# EAGLE design Inverter V3 (EAGLE 9.6.2)
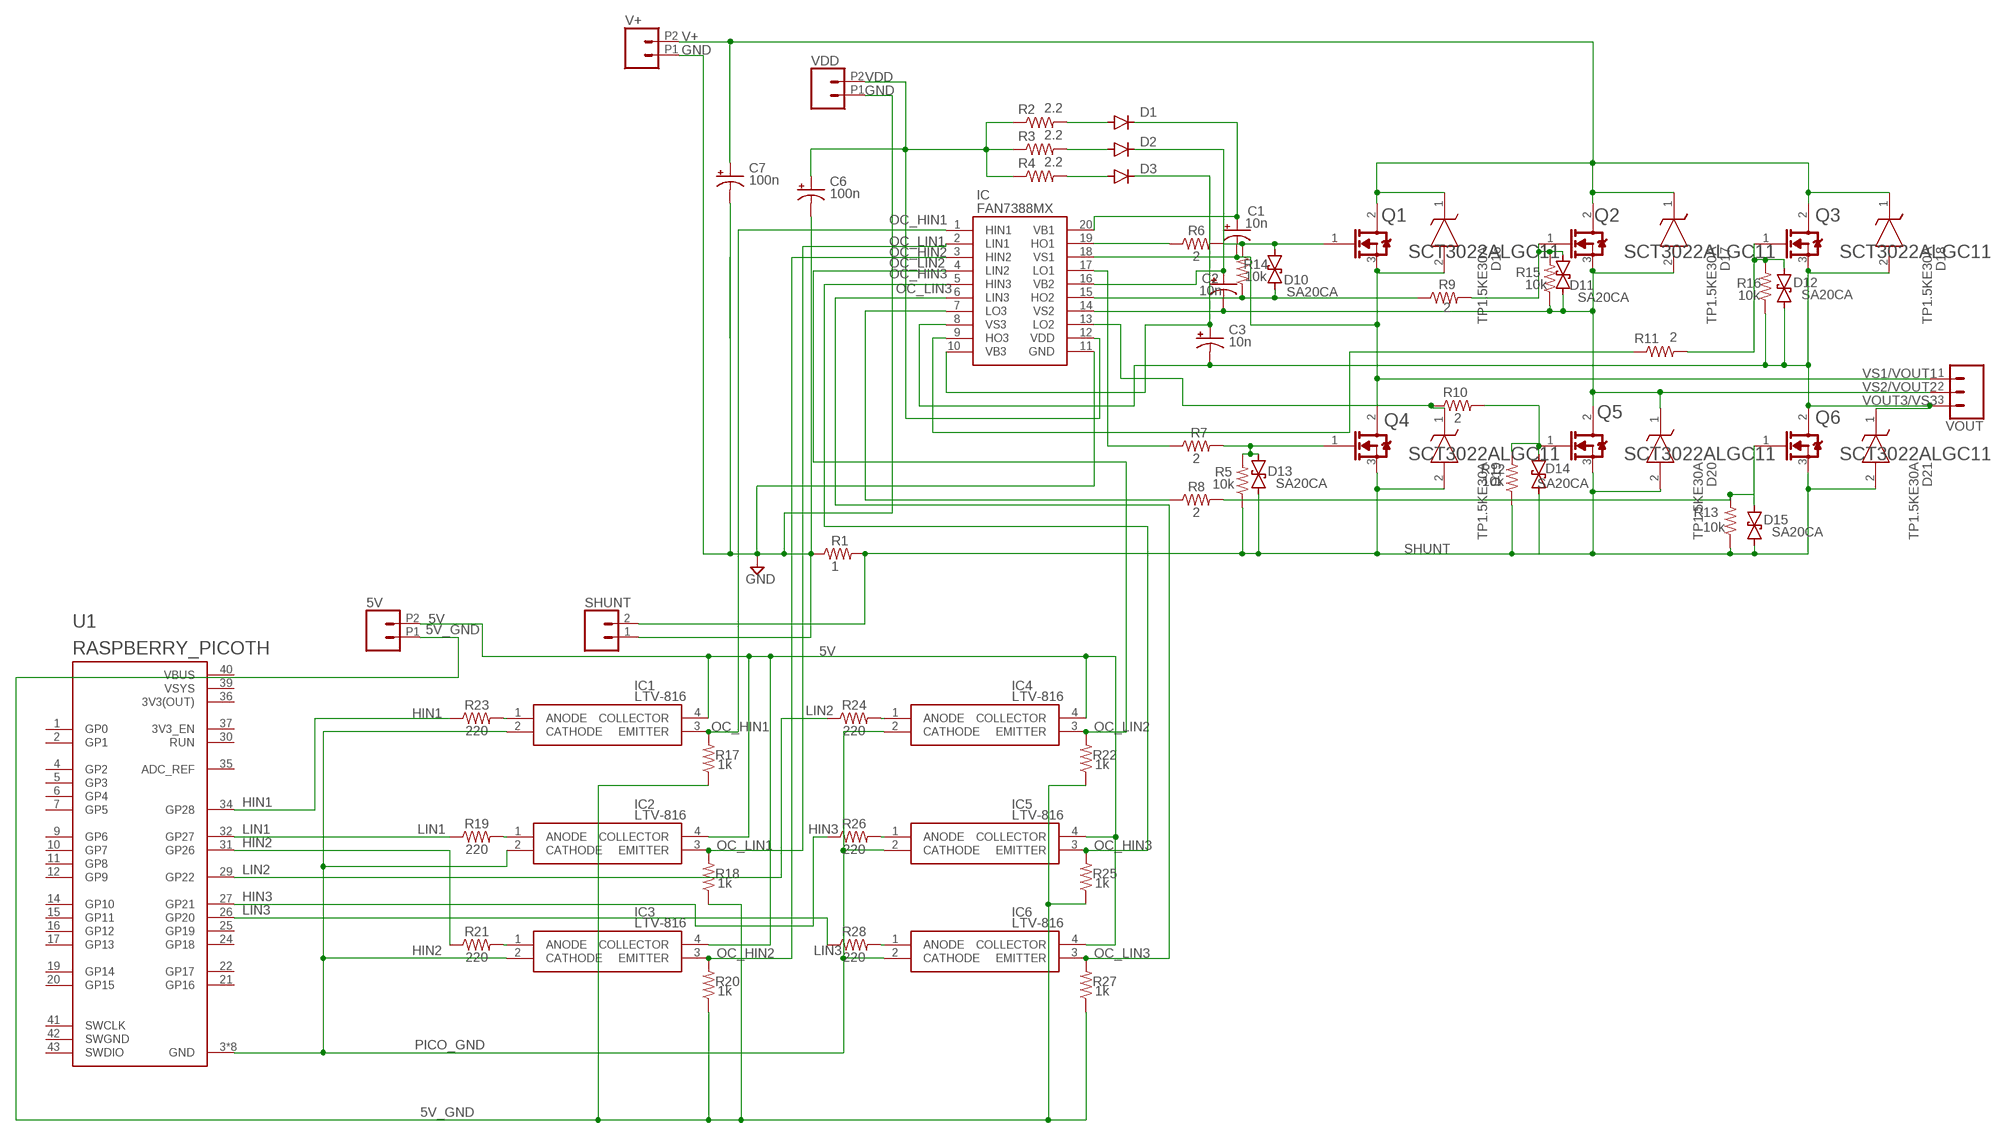
[diagram p0: schematic, sheet 1]

## Parts
5V  CONN_022.54MM_SCREWTERM  [1X02_2.54_SCREWTERM]
C1  10n  CPOL-USSMCZ  [SMC_Z]
C2  10n  CPOL-USSMCZ  [SMC_Z]
C3  10n  CPOL-USSMCZ  [SMC_Z]
C6  100n  CPOL-USSMCZ  [SMC_Z]
C7  100n  CPOL-USE5-5  [E5-5]
D1  DIODE-GF1  [GF1]
D2  DIODE-GF1  [GF1]
D3  DIODE-GF1  [GF1]
D10  SA20CA  P6KEXXC  [CB417-15]
D11  SA20CA  P6KEXXC  [CB417-15]
D12  SA20CA  P6KEXXC  [CB417-15]
D13  SA20CA  P6KEXXC  [CB417-15]
D14  SA20CA  P6KEXXC  [CB417-15]
D15  SA20CA  P6KEXXC  [CB417-15]
D16  TP1.5KE30A  [DIOAD2855W107L835D505]
D17  TP1.5KE30A  [DIOAD2855W107L835D505]
D18  TP1.5KE30A  [DIOAD2855W107L835D505]
D19  TP1.5KE30A  [DIOAD2855W107L835D505]
D20  TP1.5KE30A  [DIOAD2855W107L835D505]
D21  TP1.5KE30A  [DIOAD2855W107L835D505]
IC  FAN7388MX  [SOIC127P1032X265-20N]
IC1  LTV-816  [DIP762W60P254L460H450Q4N]
IC2  LTV-816  [DIP762W60P254L460H450Q4N]
IC3  LTV-816  [DIP762W60P254L460H450Q4N]
IC4  LTV-816  [DIP762W60P254L460H450Q4N]
IC5  LTV-816  [DIP762W60P254L460H450Q4N]
IC6  LTV-816  [DIP762W60P254L460H450Q4N]
Q1  ROHM_SCT3022ALGC11ROHM_SCT3022ALGC11_0_0  [ROHM_SCT3022ALGC11_0]
Q2  ROHM_SCT3022ALGC11ROHM_SCT3022ALGC11_0_0  [ROHM_SCT3022ALGC11_0]
Q3  ROHM_SCT3022ALGC11ROHM_SCT3022ALGC11_0_0  [ROHM_SCT3022ALGC11_0]
Q4  ROHM_SCT3022ALGC11ROHM_SCT3022ALGC11_0_0  [ROHM_SCT3022ALGC11_0]
Q5  ROHM_SCT3022ALGC11ROHM_SCT3022ALGC11_0_0  [ROHM_SCT3022ALGC11_0]
Q6  ROHM_SCT3022ALGC11ROHM_SCT3022ALGC11_0_0  [ROHM_SCT3022ALGC11_0]
R1  1  R-US_0207/10  [0207/10]
R2  2.2  RESISTOR0603  [0603]
R3  2.2  RESISTOR0603  [0603]
R4  2.2  RESISTOR0603  [0603]
R5  10k  RESISTOR0603  [0603]
R6  2  RESISTOR0603  [0603]
R7  2  RESISTOR0603  [0603]
R8  2  RESISTOR0603  [0603]
R9  2  RESISTOR0603  [0603]
R10  2  RESISTOR0603  [0603]
R11  2  RESISTOR0603  [0603]
R12  10k  RESISTOR0603  [0603]
R13  10k  RESISTOR0603  [0603]
R14  10k  RESISTOR0603  [0603]
R15  10k  RESISTOR0603  [0603]
R16  10k  RESISTOR0603  [0603]
R17  1k  RESISTOR0603  [0603]
R18  1k  RESISTOR0603  [0603]
R19  220  RESISTOR0603  [0603]
R20  1k  RESISTOR0603  [0603]
R21  220  RESISTOR0603  [0603]
R22  1k  RESISTOR0603  [0603]
R23  220  RESISTOR0603  [0603]
R24  220  RESISTOR0603  [0603]
R25  1k  RESISTOR0603  [0603]
R26  220  RESISTOR0603  [0603]
R27  1k  RESISTOR0603  [0603]
R28  220  RESISTOR0603  [0603]
SHUNT  CONN_02PTH4  [1X02_XTRA_BIG]
U1  RASPBERRY_PICOTH  [PICO-PKG-TH]
V+  CONN_022.54MM_SCREWTERM  [1X02_2.54_SCREWTERM]
VDD  CONN_022.54MM_SCREWTERM  [1X02_2.54_SCREWTERM]
VOUT  CONN_03SCREW-NS  [SCREWTERMINAL-3.5MM-3-NS]

## Nets
5V: 5V.P2 IC1.4(COLLECTOR) IC2.4(COLLECTOR) IC3.4(COLLECTOR) IC4.4(COLLECTOR) IC5.4(COLLECTOR) IC6.4(COLLECTOR)
5V_GND: 5V.P1 R17.1 R18.1 R20.1 R22.1 R25.1 R27.1
GND: C6.- C7.- IC.11(GND) R1.1 SHUNT.1 V+.P1 VDD.P1
HIN1: R23.1 U1.34(GP28)
HIN2: R21.1 U1.31(GP26)
HIN3: R26.1 U1.27(GP21)
HO1: IC.19(HO1) R6.1
HO2: D10.A IC.15(HO2) R9.1 R14.1
HO3: IC.9(HO3) R11.1
LIN1: R19.1 U1.32(GP27)
LIN2: R24.1 U1.29(GP22)
LIN3: R28.1 U1.26(GP20)
LO1: IC.17(LO1) R7.1
LO2: D19.1(K) IC.13(LO2) R10.1
LO3: IC.7(LO3) R8.1
N$1: IC3.1(ANODE) R21.2
N$2: IC2.1(ANODE) R19.2
N$3: IC1.1(ANODE) R23.2
N$4: IC4.1(ANODE) R24.2
N$5: IC5.1(ANODE) R26.2
N$6: IC6.1(ANODE) R28.2
N$13: D1.A R2.2
N$15: D2.A R3.2
N$17: D3.A R4.2
OC_HIN1: IC1.3(EMITTER) IC.1(HIN1) R17.2
OC_HIN2: IC3.3(EMITTER) IC.3(HIN2) R20.2
OC_HIN3: IC5.3(EMITTER) IC.5(HIN3) R25.2
OC_LIN1: IC2.3(EMITTER) IC.2(LIN1) R18.2
OC_LIN2: IC4.3(EMITTER) IC.4(LIN2) R22.2
OC_LIN3: IC6.3(EMITTER) IC.6(LIN3) R27.2
PICO_GND: IC1.2(CATHODE) IC2.2(CATHODE) IC3.2(CATHODE) IC4.2(CATHODE) IC5.2(CATHODE) IC6.2(CATHODE) U1.3(GND) U1.8(GND) U1.13(GND) U1.18(GND) U1.23(GND) U1.28(GND) U1.33(GND) U1.38(GND)
SHUNT: D13.A D14.A D15.A D19.2(A) D20.2(A) D21.2(A) Q4.3(SOURCE) Q5.3(SOURCE) Q6.3(SOURCE) R1.2 R5.1 R12.1 R13.1 SHUNT.2
V+: C7.+ D16.1(K) D17.1(K) D18.1(K) Q1.2(DRAIN) Q2.2(DRAIN) Q3.2(DRAIN) V+.P2
VB1: C1.+ D1.C IC.20(VB1)
VB2: C2.+ D2.C IC.16(VB2)
VB3: C3.+ D3.C IC.10(VB3)
VDD: C6.+ IC.12(VDD) R2.1 R3.1 R4.1 VDD.P2
VGIN1: D10.C Q1.1(GATE) R6.2 R14.2
VGIN2: D11.C Q2.1(GATE) R9.2 R15.2
VGIN3: D12.C Q3.1(GATE) R11.2 R16.2
VGIN4: D13.C Q4.1(GATE) R5.2 R7.2
VGIN5: D14.C Q5.1(GATE) R10.2 R12.2
VGIN6: D15.C Q6.1(GATE) R8.2 R13.2
VOUT3/VS3: C3.- D12.A D18.2(A) D21.1(K) IC.8(VS3) Q3.3(SOURCE) Q6.2(DRAIN) R16.1 VOUT.3
VS1/VOUT1: C1.- D16.2(A) IC.18(VS1) Q1.3(SOURCE) Q4.2(DRAIN) VOUT.1
VS2/VOUT2: C2.- D11.A D17.2(A) D20.1(K) IC.14(VS2) Q2.3(SOURCE) Q5.2(DRAIN) R15.1 VOUT.2
Unconnected: U1.1(GP0) U1.2(GP1) U1.4(GP2) U1.5(GP3) U1.6(GP4) U1.7(GP5) U1.9(GP6) U1.10(GP7) U1.11(GP8) U1.12(GP9) U1.14(GP10) U1.15(GP11) U1.16(GP12) U1.17(GP13) U1.19(GP14) U1.20(GP15) U1.21(GP16) U1.22(GP17) U1.24(GP18) U1.25(GP19) U1.30(RUN) U1.35(ADC_REF) U1.37(3V3_EN) U1.41(SWCLK) U1.43(SWDIO)

## Power pins joined to a net without a drawn wire
3V3(OUT): U1.36(3V3(OUT))
SWGND: U1.42(SWGND)
VBUS: U1.40(VBUS)
VSYS: U1.39(VSYS)

## Library data of the parts
5V SHUNT V+ VDD = SparkFun-Connectors:CONN_02: Multi connection point. Often used as Generic Header-pin footprint for 0.1 inch spaced/style header connections On any of the 0.1 inch spaced packages, you can populate with these: Break Away Headers - Straight <https://www.sparkfun.com/products/116> (PRT-00116) Break Away Male Headers - Right Angle <https://www.sparkfun.com/products/553> (PRT-00553) Female Headers <https://www.sparkfun.com/products/115> (PRT-00115) Break Away Headers - Machine Pin <https://www.sparkfun.com/products/117> (PRT-00117) Break Away Female Headers - Swiss Machine Pin <https://www.sparkfun.com/products/743> (PRT-00743) For SCREWTERMINALS and SPRING TERMINALS visit here: Screw Terimnals on SparkFun.com <https://www.sparkfun.com/search/results?term=Screw+Terminals> (5mm/3.5mm/2.54mm spacing) This device is also useful as a general connection point to wire up your design to another part of your project. Our various solder wires solder well into these plated through hole pads. Hook-Up Wire - Assortment (Stranded, 22 AWG) <https://www.sparkfun.com/products/11375> (PRT-11375) Hook-Up Wire - Assortment (Solid Core, 22 AWG) <https://www.sparkfun.com/products/11367> (PRT-11367) View the entire wire category on our website here <https://www.sparkfun.com/categories/141> Special notes: Molex polarized connector foot print use with: PRT-08233 with associated crimp pins and housings. 2.54_SCREWTERM for use with PRT-10571. 3.5mm Screw Terminal footprints for PRT-08084 5mm Screw Terminal footprints for use with PRT-08432
C1-C3 C6 C7 = rcl:CPOL-US: POLARIZED CAPACITOR, American symbol; SPICEPREFIX: C
D1-D3 = diode:DIODE-: DIODE
D10-D15 = diode:P6KEXXC: DIODE transient-voltage suppressor
D16-D21 = TP1.5KE30A:TP1.5KE30A: ESD Suppressors / TVS Diodes 30V 1.5kW UNI-DIR TP1.5KE AEC-Q101 Source: Datasheet <https://www.littelfuse.com/~/media/electronics/datasheets/tvs_diodes/littelfuse_tvs_diode_tp1_5ke_datasheet.pdf.pdf>; DESCRIPTION: ESD Suppressors / TVS Diodes 30V 1.5kW UNI-DIR TP1.5KE AEC-Q101; HEIGHT: mm; MANUFACTURER_NAME: LITTELFUSE; MANUFACTURER_PART_NUMBER: TP1.5KE30A; MOUSER_PART_NUMBER: 576-TP1.5KE30A; MOUSER_PRICE-STOCK: https://www.mouser.co.uk/ProductDetail/Littelfuse/TP15KE30A?qs=TBuKNwnxMrMcQ0tjwTx2Ug%3D%3D
IC = FAN7388MX:FAN7388MX: IC, Fairchild, FAN7388MX Fairchild Semiconductor FAN7388MX, Triple MOSFET Power Driver 350 mA, 650 mA Half Bridge, 10 20 V, Inverting Source: Datasheet <https://componentsearchengine.com/Datasheets/1/FAN7388MX.pdf>; DESCRIPTION: IC, Fairchild, FAN7388MX Fairchild Semiconductor FAN7388MX, Triple MOSFET Power Driver 350 mA, 650 mA Half Bridge, 10 20 V, Inverting; HEIGHT: 2.65mm; MANUFACTURER_NAME: onsemi; MANUFACTURER_PART_NUMBER: FAN7388MX; MOUSER_PART_NUMBER: 512-FAN7388MX; MOUSER_PRICE-STOCK: https://www.mouser.com/Search/Refine.aspx?Keyword=512-FAN7388MX
IC1-IC6 = LTV-816:LTV-816: Optocoupler Transistor Output, 80V, DIP4 Lite-On LTV-816 DC Input Transistor Output Optocoupler, Through Hole, 4-Pin PDIP Source: Datasheet; DESCRIPTION: Optocoupler Transistor Output, 80V, DIP4 Lite-On LTV-816 DC Input Transistor Output Optocoupler, Through Hole, 4-Pin PDIP; HEIGHT: 4.5mm; MANUFACTURER_NAME: Lite-On; MANUFACTURER_PART_NUMBER: LTV-816; MOUSER_PART_NUMBER: 859-LTV-816; MOUSER_PRICE-STOCK: https://www.mouser.co.uk/ProductDetail/Lite-On/LTV-816?qs=sfOAxtv3rnlEM8E%2Fng3XdA%3D%3D
Q1-Q6 = ROHM - SCT3022ALGC11:ROHM_SCT3022ALGC11: MOSFET NCH 650V 93A TO247N; CENTROID_NOT_SPECIFIED: No; CONTINUOUS_DRAIN_CURRENT: 93A; DATASHEET: https://www.rohm.com/datasheet/SCT3022AL/sct3022al-e; DEVICE_CLASS_L1: Discrete Semiconductors; DEVICE_CLASS_L2: Transistors; DEVICE_CLASS_L3: MOSFETs; DIGIKEY_DESCRIPTION: TRANS MOSFET NCH 650V 93A TO247N; DIGIKEY_PART_NUMBER: SCT3022ALGC11-ND; DRAIN_TO_SOURCE_BREAKDOWN_VOLTAGE: 650V; DRAIN_TO_SOURCE_RESISTANCE: 22mΩ; DRAIN_TO_SOURCE_VOLTAGE: 650V; FOOTPRINT_URL: https://d1d2qsbl8m0m72.cloudfront.net/en/techdata_basic/power/dimension/SiC_TO-247N-e.pdf; GATE_TO_SOURCE_VOLTAGE: 22V; HEIGHT: 25.5mm; INPUT_CAPACITACE_AT_VDS: 2208pF @ 500V; LEAD_FREE: yes; MAX_JUNCTION_TEMP: +175°C; MF: ROHM; MFG_PACKAGE_IDENT: SCT3022ALGC11; MFG_PACKAGE_IDENT_DATE: 2/2017; MFG_PACKAGE_IDENT_REV: 001; MOUSER_DESCRIPTION: SCT3022AL Series 650 V 93 A 28.6 mOhm N-Channel SiC Power Mosfet - TO-247N; MOUSER_PART_NUMBER: 755-SCT3022ALGC11; MPN: SCT3022ALGC11; NUMBER_OF_CHANNELS: 1; NUMBER_OF_N_CHANNELS: 1; PACKAGE: TO247; POWER_DISSIPATION: 339W; PREFIX: Q; ROHS: yes; STANDOFF_HEIGHT: 3.8mm; TECHNOLOGY: MOSFET; TEMPERATURE_RANGE_HIGH: +175°C; THRESHOLD_VGS: 2.7V; TURN_OFF_DELAY_TIME: 61ns; TURN_ON_DELAY_TIME: 25ns; VERIFICATION_VERSION: 0.0.0.1
R1 = rcl:R-US_: RESISTOR, American symbol; SPICEPREFIX: R
R2-R28 = SparkFun-Resistors:RESISTOR: Generic Resistor Package
U1 = RpiPico:RASPBERRY_PICO: Raspberry Pi Pico
VOUT = SparkFun-Connectors:CONN_03: Multi connection point. Often used as Generic Header-pin footprint for 0.1 inch spaced/style header connections On any of the 0.1 inch spaced packages, you can populate with these: Break Away Headers - Straight <https://www.sparkfun.com/products/116> (PRT-00116) Break Away Male Headers - Right Angle <https://www.sparkfun.com/products/553> (PRT-00553) Female Headers <https://www.sparkfun.com/products/115> (PRT-00115) Break Away Headers - Machine Pin <https://www.sparkfun.com/products/117> (PRT-00117) Break Away Female Headers - Swiss Machine Pin <https://www.sparkfun.com/products/743> (PRT-00743) Stackable Header - 3 Pin (Female, 0.1") <https://www.sparkfun.com/products/13875> (PRT-13875) For SCREWTERMINALS and SPRING TERMINALS visit here: Screw Terimnals on SparkFun.com <https://www.sparkfun.com/search/results?term=Screw+Terminals> (5mm/3.5mm/2.54mm spacing) This device is also useful as a general connection point to wire up your design to another part of your project. Our various solder wires solder well into these plated through hole pads. Hook-Up Wire - Assortment (Stranded, 22 AWG) <https://www.sparkfun.com/products/11375> (PRT-11375) Hook-Up Wire - Assortment (Solid Core, 22 AWG) <https://www.sparkfun.com/products/11367> (PRT-11367) View the entire wire category on our website here <https://www.sparkfun.com/categories/141> Special notes: Molex polarized connector foot print use with SKU : PRT-08232 with associated crimp pins and housings.

## Board
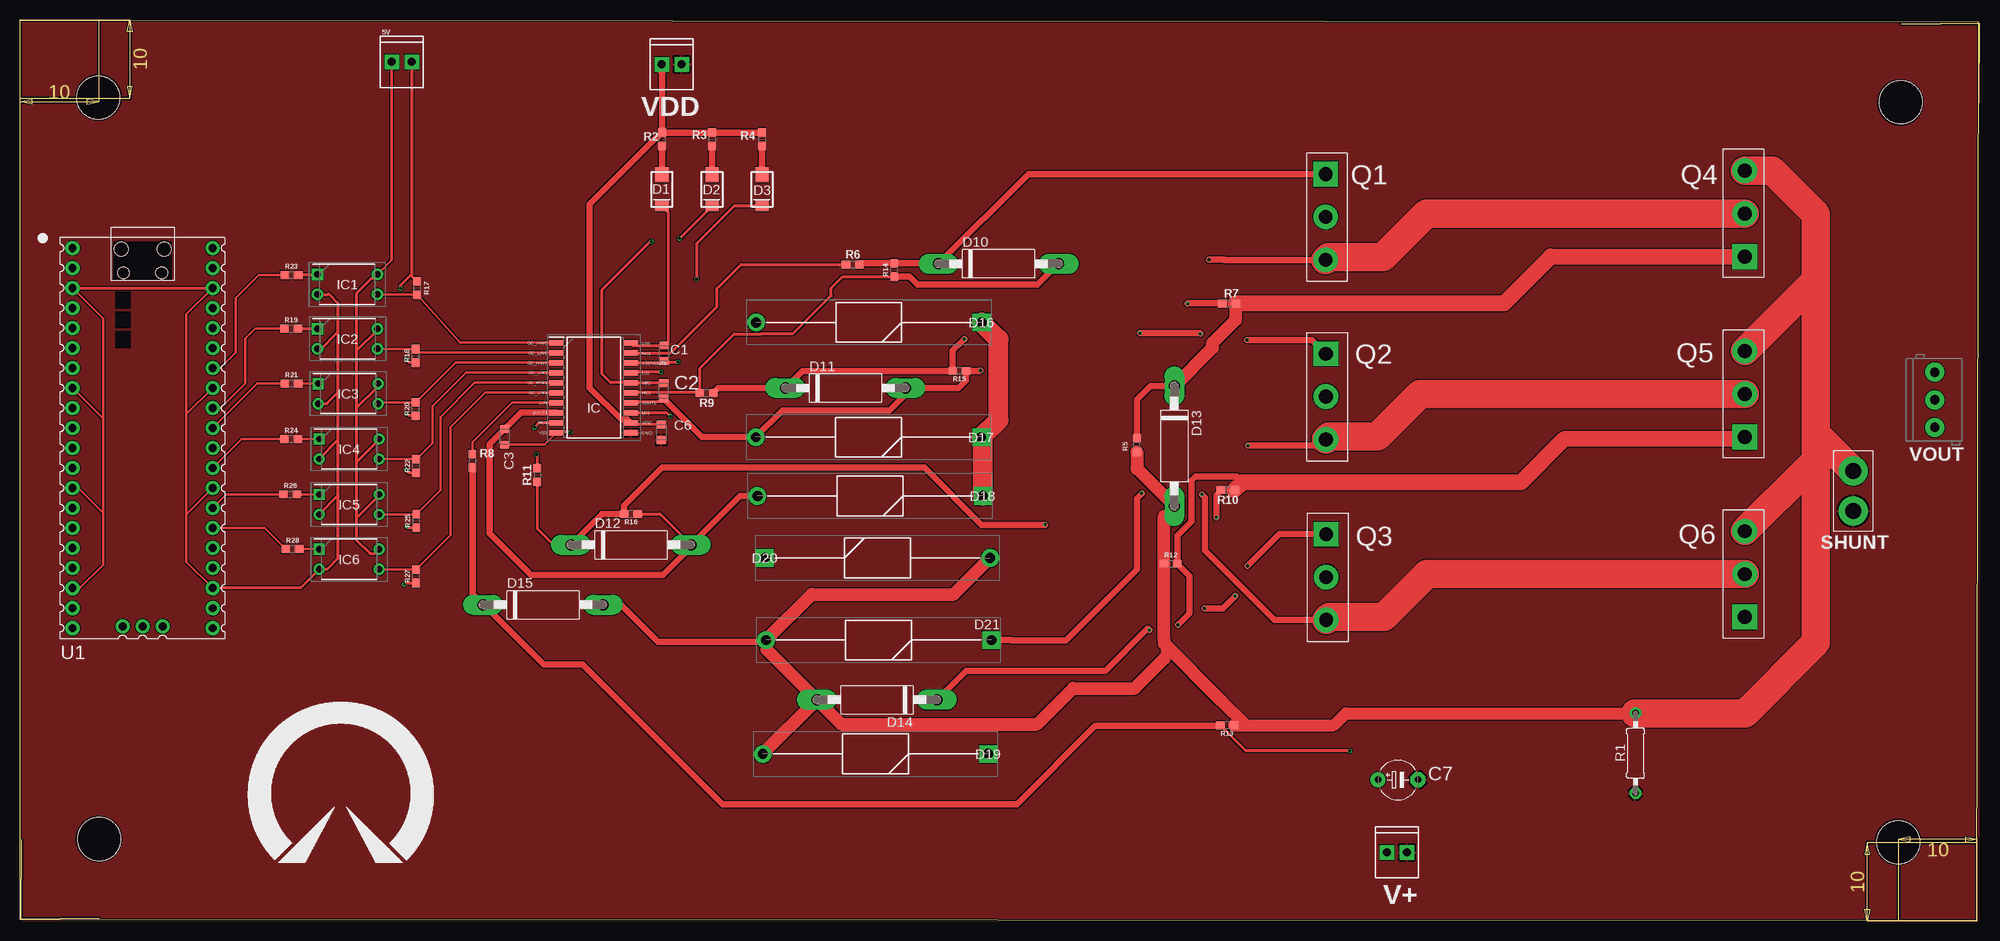
[diagram p1: board, top side]
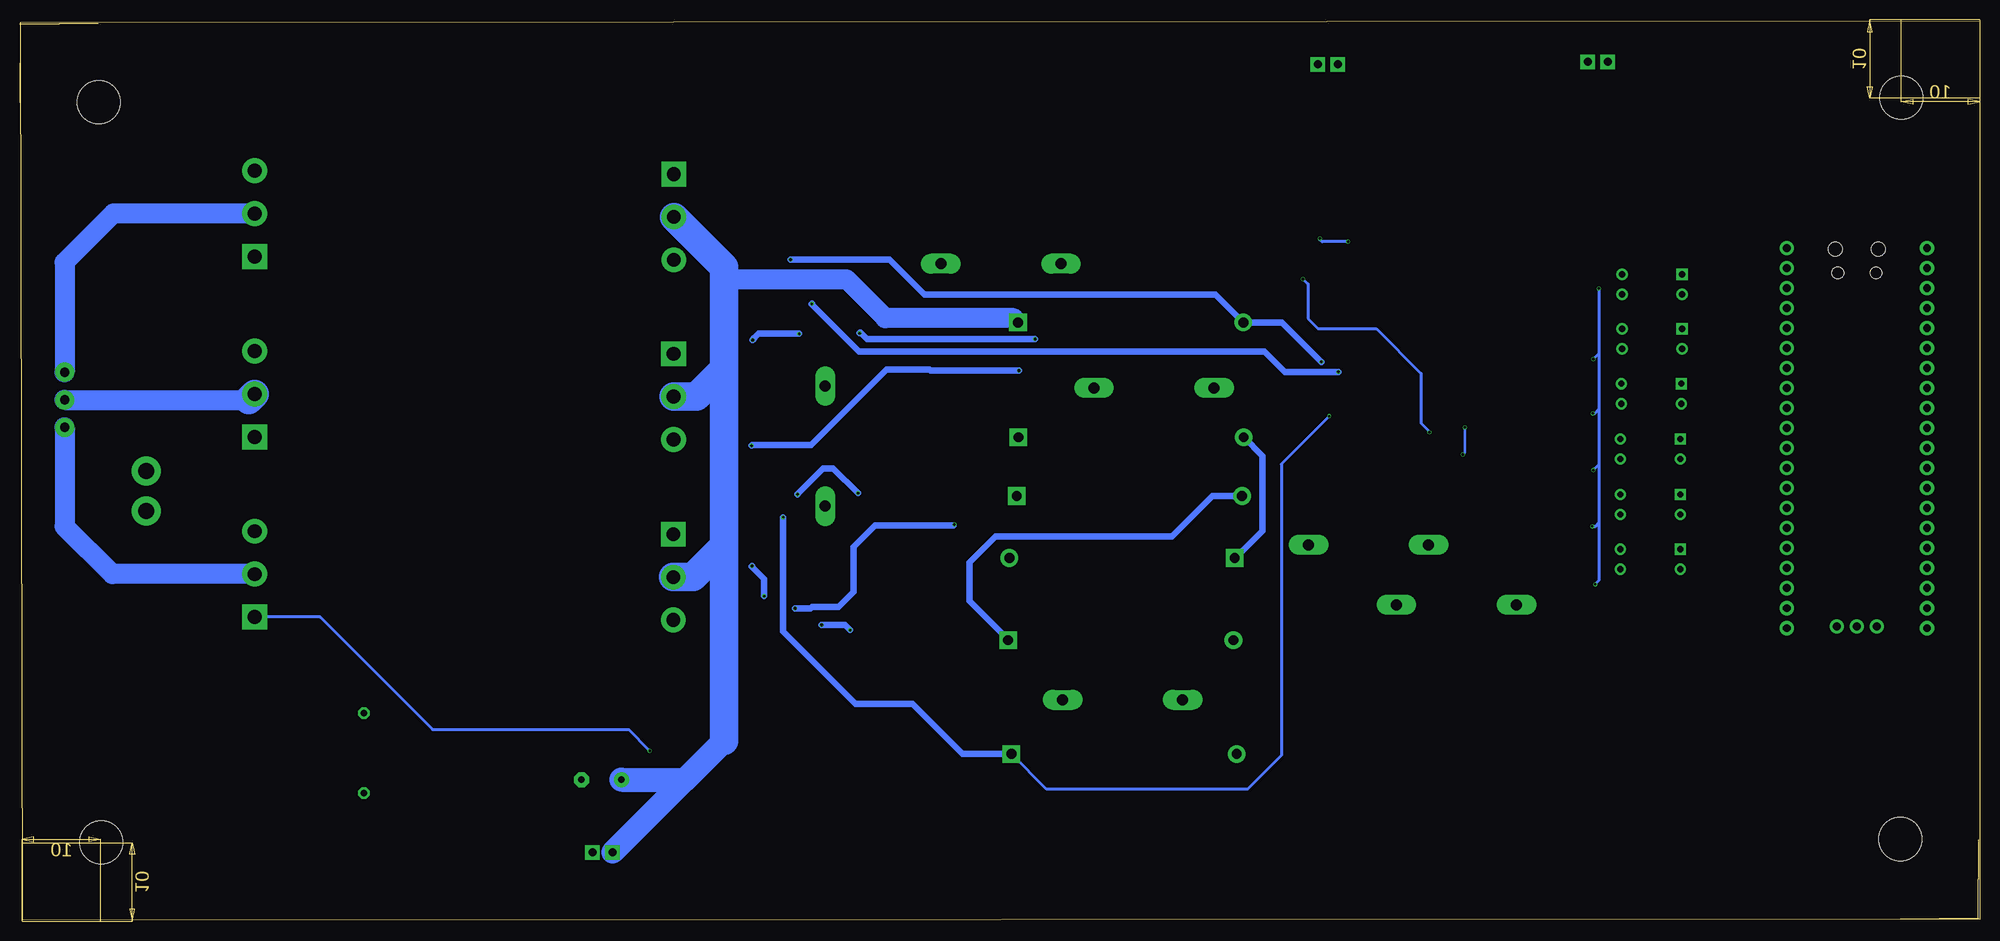
[diagram p2: board, bottom side, seen from below]

Size 248.64 x 114.2 mm. Coordinates in mm from the lower left corner, seen from the top.
Outline: 0,0.15 248.36,0 248.64,114.05 0,114.2 0,0.15
Copper layers (1*16): Top 0.035mm / dielectric 1.6mm / Bottom 0.035mm
Design rules "jlcpcb-2layers": minimum track width 5mil, minimum drill 0.3mm, track to track 5mil, track to pad 5mil, pad to pad 5mil, via to via 5mil, smd to smd 5mil, copper to edge 0.2mm, drill to drill 6mil, minimum pad ring 10mil, minimum via ring 3mil, stop-mask expansion 4mil, vias tented up to drill 0mil, thermal gap 10mil
Holes 5.5 mm at 238.71,103.86 9.96,104.47 10.06,10.34 238.38,9.93

### Footprints (pad centres in the part's own frame; a part is rotated, then mirrored left to right if it is on the bottom)
1X02_2.54_SCREWTERM = drill 1.016 square: P1 2.54,0; P2 0,0
SMC_Z = smd 1 x 1.2: + -1,0; - 1,0
E5-5 = drill 0.813 pad 1.905: + -2.54,0 | drill 0.813 pad 1.905 octagon: - 2.54,0
GF1 = smd 1.85 x 1.68: A 1.87,0 | smd 1.32 x 1.68: C -2.12,0
CB417-15 = drill 1.397 long: A 7.62,0; C -7.62,0
DIOAD2855W107L835D505 = drill 1.25 pad 1.875 square: 1 0,0 | drill 1.25 pad 1.875: 2 28.6,0
SOIC127P1032X265-20N = smd 1.875 x 0.7: 1 -4.688,5.715; 2 -4.688,4.445; 3 -4.688,3.175; 4 -4.688,1.905; 5 -4.688,0.635; 6 -4.688,-0.635; 7 -4.688,-1.905; 8 -4.688,-3.175; 9 -4.688,-4.445; 10 -4.688,-5.715; 11 4.688,-5.715; 12 4.688,-4.445; 13 4.688,-3.175; 14 4.688,-1.905; 15 4.688,-0.635; 16 4.688,0.635; 17 4.688,1.905; 18 4.688,3.175; 19 4.688,4.445; 20 4.688,5.715
DIP762W60P254L460H450Q4N = drill 0.8 pad 1.2 square: 1 -3.81,1.27 | drill 0.8 pad 1.2: 2 -3.81,-1.27; 3 3.81,-1.27; 4 3.81,1.27
ROHM_SCT3022ALGC11_0 = drill 1.75 pad 2.65 square: 1 -0.2,5.45 | drill 1.75 pad 2.65: 2 -0.2,0; 3 -0.2,-5.45
0207/10 = drill 0.813 octagon: 1 -5.08,0; 2 5.08,0
0603 = smd 1.1 x 1: 1 -0.85,0; 2 0.85,0
1X02_XTRA_BIG = drill 2.057 pad 3.556: 1 -2.54,0; 2 2.54,0
PICO-PKG-TH = drill 1: 1 -8.89,24.13; 2 -8.89,21.59; 3 -8.89,19.05; 4 -8.89,16.51; 5 -8.89,13.97; 6 -8.89,11.43; 7 -8.89,8.89; 8 -8.89,6.35; 9 -8.89,3.81; 10 -8.89,1.27; 11 -8.89,-1.27; 12 -8.89,-3.81; 13 -8.89,-6.35; 14 -8.89,-8.89; 15 -8.89,-11.43; 16 -8.89,-13.97; 17 -8.89,-16.51; 18 -8.89,-19.05; 19 -8.89,-21.59; 20 -8.89,-24.13; 21 8.89,-24.13; 22 8.89,-21.59; 23 8.89,-19.05; 24 8.89,-16.51; 25 8.89,-13.97; 26 8.89,-11.43; 27 8.89,-8.89; 28 8.89,-6.35; 29 8.89,-3.81; 30 8.89,-1.27; 31 8.89,1.27; 32 8.89,3.81; 33 8.89,6.35; 34 8.89,8.89; 35 8.89,11.43; 36 8.89,13.97; 37 8.89,16.51; 38 8.89,19.05; 39 8.89,21.59; 40 8.89,24.13; 41 -2.54,-23.9; 42 0,-23.9; 43 2.54,-23.9 | hole 1.8: -2.725,24; 2.725,24 | hole 1.5: -2.425,20.97; 2.425,20.97
SCREWTERMINAL-3.5MM-3-NS = drill 1.2 pad 2.413: 1 0,0; 2 3.5,0; 3 7,0

### Placement (x,y rotation side)
5V  47.19,108.99 0 top
C1  81.76,72.01 270 top
C2  81.71,67.23 270 top
C3  61.52,61.39 90 top
C6  81.41,61.98 270 top
C7  174.9,17.86 0 top
D1  81.48,92.81 90 top
D2  87.83,92.81 90 top
D3  94.18,92.81 90 top
D10  124.21,83.36 0 top
D11  104.78,67.59 0 top
D12  77.55,47.68 0 top
D13  146.51,60.22 270 top
D14  108.76,28.02 180 top
D15  66.4,40.08 0 top
D16  122.05,75.92 180 top
D17  122,61.34 180 top
D18  122.2,53.9 180 top
D19  122.89,21.13 180 top
D20  94.54,46.02 0 top
D21  123.29,35.59 180 top
IC  72.82,67.64 0 top
IC1  41.55,80.75 0 top
IC2  41.58,73.84 0 top
IC3  41.66,66.88 0 top
IC4  41.78,59.84 0 top
IC5  41.78,52.81 0 top
IC6  41.78,45.85 0 top
Q1  165.91,89.31 0 top
Q2  165.94,66.49 0 top
Q3  165.99,43.59 0 top
Q4  218.72,89.74 180 top
Q5  218.72,66.83 180 top
Q6  218.72,43.97 180 top
R1  205.05,21.23 90 top
R2  81.48,99.16 270 top
R3  87.83,99.16 270 top
R4  94.18,99.16 270 top
R5  141.76,60.35 90 top
R6  105.7,83.27 0 top
R7  153.47,78.33 0 top
R8  57.43,58.34 270 top
R9  87.15,66.95 0 top
R10  153.29,54.63 0 top
R11  65.66,56.54 270 top
R12  146.05,45.29 0 top
R13  153.21,24.76 180 top
R14  110.97,82.58 90 top
R15  119.23,69.77 180 top
R16  77.55,51.61 180 top
R17  50.39,80.29 270 top
R18  50.24,71.68 90 top
R19  34.42,75.13 0 top
R20  50.24,64.92 90 top
R21  34.47,68.17 0 top
R22  50.29,57.68 90 top
R23  34.47,81.94 0 top
R24  34.42,61.11 0 top
R25  50.32,50.7 90 top
R26  34.32,54.1 0 top
R27  50.29,43.69 90 top
R28  34.59,47.14 0 top
SHUNT  232.69,54.51 90 top
U1  15.57,61.24 0 top
V+  173.51,8.64 0 top
VDD  81.46,108.69 0 top
VOUT  243.03,69.6 270 top

### Tracks (layer width: path | path; a pad name or v marks a point on that pad's centre or on a via)
5V
  Top 0.305: 5V.P2 47.19,83.84 IC1.4
  Top 0.406: IC1.4 45.36,81.86 44.98,81.48 44.6,81.48 42.7,79.58 42.7,72.26 | 42.7,72.26 42.7,65.05 | 42.7,65.05 42.7,58.12 | 42.7,58.12 42.7,51.05 | 42.7,51.05 42.7,48.29 44.42,46.56 45.03,46.56 IC6.4 | IC5.4 45.59,53.92 45.21,53.54 45.19,53.54 42.7,51.05 | IC4.4 45.59,60.96 45.21,60.58 45.16,60.58 42.7,58.12 | IC3.4 45.47,68 45.26,67.79 45.26,67.61 42.7,65.05 | IC2.4 45.39,74.95 42.7,72.26
5V_GND  (via drill 0.35)
  Top 0.406: 5V.P1 49.73,82.07 | 49.73,82.07 49.73,81.8 R17.1 | 49.73,82.07 48.26,80.59 48.26,80.29 v48.31,80.24 | v48.79,42.67 48.96,42.84 R27.1 | R25.1 49.29,49.85 49.15,49.99 49.15,50.01 v49.17,50.04 | R22.1 49.34,56.83 49.02,57.15 v49.03,57.16 | R20.1 49.41,64.07 49.1,64.39 v49.09,64.38 | R18.1 49.39,70.83 49,71.22 v49.03,71.26
  Bottom 0.406: v48.31,80.24 48.31,71.98 | 48.31,71.98 48.31,64.92 | 48.31,64.92 48.31,57.86 | 48.31,57.86 48.31,50.5 | 48.31,50.5 48.31,43.18 48.79,42.7 v48.79,42.67 | v49.17,50.04 48.77,50.04 48.31,50.5 | v49.03,57.16 49.01,57.16 48.31,57.86 | v49.09,64.38 48.86,64.38 48.31,64.92 | v49.03,71.26 48.31,71.98
GND
  pour Top: -0.03,114.05 248.62,114.05 248.62,-0.13 0.36,-0.13 -0.03,0.25
HIN1
  Top 0.305: U1.34 25.4,70.13 27.36,72.09 27.36,78.99 30.3,81.94 R23.1
HIN2
  Top 0.305: U1.31 30.12,68.17 R21.1
HIN3
  Top 0.305: U1.27 26.21,54.1 R26.1
HO1
  Top 0.406: IC.19 77.62,71.97 82.54,71.97 88.47,77.9 88.47,80.24 91.5,83.27 R6.1
HO2
  Top 0.406: IC.15 77.61,67.11 86.14,67.11 R9.1 86.3,70.12 90.64,74.47 94.05,74.47 94.06,74.47 98.12,74.47 102.97,79.32 102.97,80.26 104.43,81.72 R14.1
  Top 0.813: R14.1 112.92,81.72 113.94,80.7 129.16,80.7 D10.A
HO3  (via drill 0.35)
  Top 0.406: v65.57,59.14 65.66,59.05 R11.1 | v65.33,62.6 65.92,63.2 IC.9
  Bottom 0.305: v65.33,62.6 65.3,62.57 65.3,59.41 v65.57,59.14
LIN1
  Top 0.305: U1.32 25.48,65.05 28.6,68.17 28.6,73.86 29.87,75.13 R19.1
LIN2
  Top 0.305: U1.29 28.14,61.11 R24.1
LIN3
  Top 0.305: U1.26 31.08,49.81 R28.1
LO1  (via drill 0.35)
  Top 0.406: IC.17 77.64,69.67 81.38,69.67 v81.38,69.65
  Top 0.813: v148.21,78.28 148.28,78.36 152.59,78.36 R7.1
  Bottom 0.813: v81.38,69.65 88.19,69.65 90.75,72.21 142.24,72.21 148.26,78.23 v148.21,78.28
LO2  (via drill 0.35)
  Top 0.406: IC.13 82.09,64.47 v82.55,64.01
  Top 0.813: v151.84,51.18 151.84,54.04 R10.1
  Bottom 0.406: v82.55,64.01 88.62,57.94 88.62,20.96 92.91,16.66 118.42,16.66 D19.1
  Bottom 0.813: v151.84,51.18 151.87,51.16 151.87,36.7 142.65,27.48 135.46,27.48 129.11,21.13 D19.1
LO3
  Top 0.305: IC.7 62.46,65.73 57.43,60.71 R8.1
N$1
  Top 0.305: R21.2 37.82,68.17 IC3.1
N$2
  Top 0.406: R19.2 37.74,75.13 IC2.1
N$3
  Top 0.406: R23.2 35.39,82.02 IC1.1
N$4
  Top 0.305: R24.2 IC4.1
N$5
  Top 0.305: R26.2 37.95,54.1 IC5.1
N$6
  Top 0.305: R28.2 37.95,47.14 IC6.1
N$13
  Top 0.813: R2.2 D1.A
N$15
  Top 0.813: R3.2 D2.A
N$17
  Top 0.813: R4.2 D3.A
OC_HIN1
  Top 0.305: IC1.3 49.74,79.48 R17.2 55.87,73.36 IC.1
OC_HIN2
  Top 0.305: IC3.3 45.63,65.77 R20.2 55.28,70.81 IC.3
OC_HIN3
  Top 0.305: IC5.3 50.31,51.54 R25.2 53.39,54.62 53.39,63.93 57.73,68.28 IC.5
OC_LIN1
  Top 0.305: IC2.3 50.2,72.57 R18.2 50.69,72.09 IC.2
OC_LIN2
  Top 0.305: IC4.3 50.25,58.57 R22.2 52.38,60.62 52.38,65.28 56.64,69.55 IC.4
OC_LIN3
  Top 0.305: IC6.3 50.23,44.58 R27.2 54.69,48.93 54.69,62.66 59.03,67 IC.6
PICO_GND
  Top 0.305: U1.28 21.13,51.56 | U1.23 21.13,45.52 21.13,51.56 | U1.18 7.59,42.19 10.57,45.16 10.57,51.71 | 10.57,51.71 7.39,54.89 U1.13 | U1.8 10.57,63.7 | 10.57,63.7 10.57,51.71 | U1.33 21.13,64.26 | 21.13,64.26 21.13,51.56 | U1.38 21.13,76.96 21.13,64.26 | U1.3 10.57,76.4 10.57,63.7
  Top 0.406: U1.23 24.56,42.29 35.69,42.29 IC6.2 39.01,44.58 40.36,45.92 40.36,53.92 | IC1.2 39.12,79.48 39.19,79.55 40.36,78.38 40.36,74.68 | 40.36,74.68 40.36,67 | 40.36,67 40.36,60.96 | 40.36,60.96 40.36,53.92 | IC5.2 40.36,53.92 | IC4.2 40.36,60.96 | IC3.2 38.96,65.61 40.36,67 | IC2.2 38.25,72.57 40.36,74.68 | U1.3 U1.38
SHUNT
  Top 0.813: 94.78,34.38 94.78,35.67 D21.2 94.44,35.33 81.03,35.33 76.28,40.08 D15.A | D19.2 94.28,21.16 | 145.2,35.59 145.2,35.14 145.2,33.21 | 145.2,51.3 D13.A
  Top 1.524: R13.1 155.57,24.77 | 155.57,24.77 166.75,24.77 168.3,26.31 R1.2 | 155.57,24.77 152.45,27.89
  Top 1.626: 94.78,35.67 100.51,41.4 118.52,41.4 D20.2 | D14.A 94.78,34.38 | 94.28,21.16 D14.A | 152.45,27.89 145.2,35.14 | 145.2,35.59 R12.1 145.2,51.3 | R5.1 141.76,57.35 D13.A | D14.A 104.27,24.89 129.08,24.89 133.68,29.49 141.48,29.49 145.2,33.21
  Top 3.607: R1.2 218.97,26.31 227.94,35.28 227.94,57.71 | 227.94,57.71 227.94,61.24 | 227.94,61.24 227.94,81.3 | Q4.3 222.44,95.19 227.94,89.69 227.94,81.3 | Q5.3 227.94,81.3 | Q6.3 227.21,57.71 227.94,57.71 | SHUNT.2 228.5,61.24 227.94,61.24
V+
  Top 0.813: D17.1 122.2,61.14
  Top 2.54: D17.1 124.21,63.55 124.21,73.76 D16.1 | 122.2,61.14 D18.1
  Bottom 1.702: D16.1 122.58,76.45
  Bottom 2.54: 159.33,81.41 143.81,81.41 138.86,76.45 122.58,76.45
  Bottom 2.87: 164.29,17.86 V+.P2
  Bottom 3.048: C7.+ 164.29,17.86 159.33,22.81
  Bottom 3.607: Q1.2 159.33,82.93 159.33,81.41 159.33,69.98 | Q3.2 163.3,43.59 159.33,47.55 | Q2.2 162.82,66.49 159.33,69.98 | 159.33,47.55 159.33,22.81 | 159.33,47.55 159.33,69.98
VB1
  Top 0.406: IC.20 77.92,72.95 81.7,72.95 C1.+ 82.3,73.54 82.3,89.88 D1.C
VB2  (via drill 0.35)
  Top 0.406: D2.C v83.72,86.58 | C2.+ 81.67,68.28 IC.16 74.98,68.28 73.89,69.37 73.89,80.09 80.06,86.26 v80.15,86.17
  Bottom 0.406: v80.15,86.17 83.43,86.17 83.72,86.46 v83.72,86.58
VB3  (via drill 0.35)
  Top 0.305: IC.10 66.6,60.39 C3.+
  Top 0.406: D3.C 90.74,90.69 90.7,90.73 85.88,85.9 v85.88,81.43 | v69.83,61.98 68.19,61.98 IC.10
  Bottom 0.406: v85.88,81.43 85.24,80.8 85.24,76.43 83.95,75.13 76.58,75.13 70.89,69.44 70.89,63.14 69.77,62.03 v69.83,61.98
VDD
  Top 0.406: IC.12 77.73,62.98 C6.+
  Top 0.813: 81.48,107.8 R2.1 | R2.1 R3.1 R4.1 | IC.12 77.12,63.58 76.35,63.58 72.31,67.62 72.31,90.95 80.76,99.39 80.87,99.39 R2.1
  Top 1.016: VDD.P2 81.48,107.8
VGIN1
  Top 0.813: R6.2 106.7,83.42 R14.2 116.52,83.42 D10.C 127.98,94.76 Q1.1
VGIN2  (via drill 0.35)
  Top 0.813: v155.74,73.67 164.01,73.67 Q2.1 | R9.2 88.63,67.59 D11.C 99.34,69.77 R15.2 118.38,72.33 v119.86,73.81 | v142.14,74.55 149.73,74.55 v149.81,74.47
  Bottom 0.813: v155.74,73.67 155.75,73.69 155.45,73.99 154.97,74.47 v149.81,74.47 | v119.86,73.81 141.22,73.81 142.04,74.62 142.06,74.62 v142.14,74.55
VGIN3  (via drill 0.35)
  Top 0.406: D12.C 67.72,47.68 65.66,49.73 R11.2 | 130.12,50.22 v130.12,50.27
  Top 0.813: v155.79,45 159.83,49.04 Q3.1 | D12.C 73.86,51.61 R16.2 76.7,52.69 81.48,57.48 114.78,57.48 122.05,50.22 130.12,50.22 | v150.34,39.62 152.71,39.62 v154.25,41.17
  Bottom 0.406: v130.12,50.27 130.25,50.14 | 148.39,39.62 148.18,39.83
  Bottom 0.813: v155.79,45 155.85,44.93 154.25,43.33 v154.25,41.17 | 130.25,50.14 140.18,50.14 142.93,47.4 142.93,41.73 144.83,39.83 148.18,39.83 | v150.34,39.62 148.39,39.62
VGIN4
  Top 0.813: R5.2 141.76,66.12 143.49,67.84 D13.C
  Top 1.626: D13.C 151.38,72.72 151.38,73.32 154.31,76.25 R7.2
  Top 2.032: R7.2 188.34,78.33 194.3,84.29 Q4.1
VGIN5  (via drill 0.35)
  Top 0.813: D14.C 120.07,31.7 137.77,31.7 143.05,36.98 143.21,36.98 v143.33,36.86 | v146.96,37.52 148.44,38.99 148.44,43.75 R12.2 146.9,48.86 148.67,50.62 148.67,55.88 149.17,56.39 154.48,56.39 155.25,55.63
  Top 2.032: R10.2 155.13,55.63 155.25,55.63 190.5,55.63 195.97,61.1 218.64,61.1 Q5.1
  Bottom 0.813: v143.33,36.86 143.99,37.52 v146.96,37.52
VGIN6  (via drill 0.35)
  Top 0.406: R13.2 152.46,24.67 155.51,21.62 168.78,21.62 v168.78,21.54
  Top 0.813: R8.2 57.43,41.43 D15.C 58.93,40.08 66.5,32.51 71.42,32.51 89.18,14.76 126.54,14.76 136.46,24.67 152.46,24.67
  Bottom 0.406: v168.78,21.54 171.47,24.23 196.34,24.23 210.63,38.52 Q6.1
VOUT3/VS3  (via drill 0.35)
  Top 0.406: R16.1 81.23,51.61 D12.A | 142.39,54.2 v142.35,54.24
  Top 0.813: IC.8 63.59,64.47 C3.- 59.64,60.51 59.64,49.12 64.87,43.89 81.64,43.89 85.17,47.42 D12.A 91.39,53.9 D18.2 | v150.01,54.1 150.42,53.7 150.42,46.96 159.25,38.14 Q3.3 | D21.1 125.83,35.59 125.86,35.56 132.74,35.56 141.76,44.58 141.76,53.57 142.39,54.2
  Top 3.607: Q3.3 166.17,38.52 173.11,38.52 178.56,43.97 Q6.2
  Bottom 0.406: 123.27,35.59 D21.1 | VOUT.3
  Bottom 0.813: v150.01,54.1 150.01,54.15 146.76,57.4 145.52,57.4 v142.35,54.24 | D18.2 97.36,53.9 102.51,48.74 124.92,48.74 128.22,45.44 128.22,40.54 123.27,35.59
  Bottom 2.54: Q6.2 236.96,43.97 243.03,50.04 VOUT.3
VS1/VOUT1  (via drill 0.35)
  Top 0.406: IC.18 81.57,70.81 C1.- 81.86,70.92 v83.54,70.92
  Top 0.813: Q1.3 152.87,83.86 152.83,83.9 v150.9,83.9
  Top 3.607: Q1.3 166.09,84.24 173.01,84.24 178.51,89.74 Q4.2
  Bottom 0.813: v83.54,70.92 88.54,75.92 D16.2 97,79.48 133.91,79.48 138.33,83.9 v150.9,83.9
  Bottom 2.54: Q4.2 236.85,89.74 243.03,83.57 VOUT.1
VS2/VOUT2  (via drill 0.35)
  Top 0.406: IC.14 78.41,65.73 78.5,65.83 81.03,65.83 81.43,66.23 C2.-
  Top 0.813: v155.85,60.27 164.97,60.27 Q2.3 | v121.91,69.81 121.82,69.72 121.77,69.77 R15.1 120.08,68.57 119.1,67.59 D11.A 112.39,66.78 110.36,64.74 96.8,64.74 D17.2 86.61,61.34 C2.- | Q5.2
  Top 3.607: Q2.3 166.12,61.42 172.27,61.42 177.67,66.83 Q5.2
  Bottom 0.406: 94.44,46.02 D20.1
  Bottom 0.813: v155.85,60.27 155.78,60.35 148.34,60.35 138.74,69.95 133.3,69.95 133.16,69.81 v121.91,69.81 | D17.2 91.03,58.98 91.03,49.43 94.44,46.02
  Bottom 2.54: VOUT.2 219.65,66.1
  Bottom 3.607: 219.65,66.1 Q5.2

### Text on the board
tPlace: OC_HIN1 / OC_LIN1 / OC_HIN2 / OC_LIN2 / OC_HIN3 / OC_LIN3 / LO3 / VOUT3 / HO3 / VB3 | VB1 / HO1 / VS1/VOUT1 / LO1 / VB2 / HO2 / VOUT2 / LO2 / VDD / GND